# Altium schematic sheet CON_HOSTJTAG_10WBOXHDRRAM.SchDoc: Host JTAG Header
size A4; Organization: Altium Limited.; Address1: Level 3, 12a Rodborough Rd; Address2: Frenchs Forest 2086; Address3: NSW; Address4: AUSTRALIA; SheetNumber: 1; SheetTotal: 100
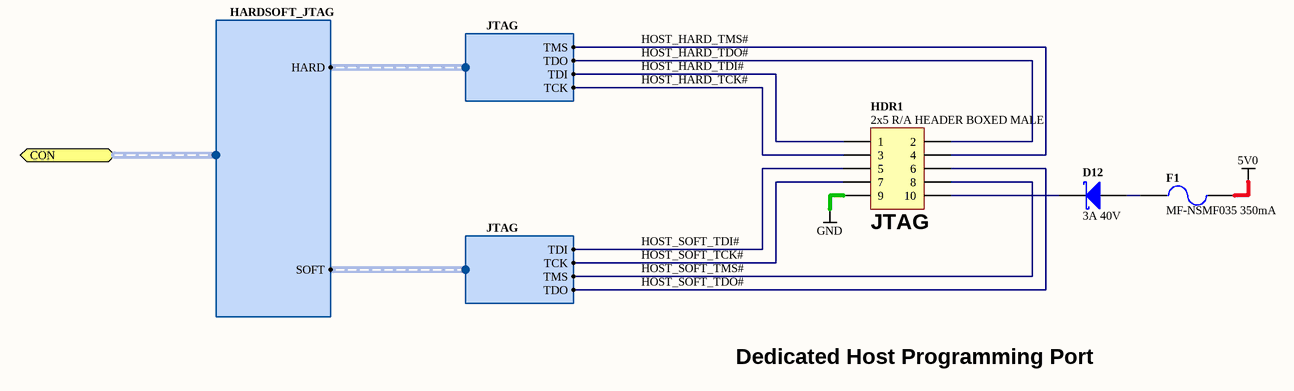
[diagram p0: CON_HOSTJTAG_10WBOXHDRRAM.SchDoc]

## Parts
D12  3A 40V  [DIOM5027]
F1  MF-NSMF035 350mA  [RESC3216]
HDR1  2x5 R/A HEADER BOXED MALE  [918510x323]

## Ports
CON (harness HARDSOFT_JTAG)

## Harnesses
JTAG: TMS, TDO, TDI, TCK
HARDSOFT_JTAG: HARD, SOFT

## Nets
5V0: F1.2
GND: HDR1.9
HOST_HARD_TCK#: HDR1.3 ; harness JTAG.TCK
HOST_HARD_TDI#: HDR1.1 ; harness JTAG.TDI
HOST_HARD_TDO#: HDR1.2 ; harness JTAG.TDO
HOST_HARD_TMS#: HDR1.4 ; harness JTAG.TMS
HOST_SOFT_TCK#: HDR1.7 ; harness JTAG.TCK
HOST_SOFT_TDI#: HDR1.5 ; harness JTAG.TDI
HOST_SOFT_TDO#: HDR1.6 ; harness JTAG.TDO
HOST_SOFT_TMS#: HDR1.8 ; harness JTAG.TMS
NetD12_1: D12.1(A) F1.1
NetD12_2: D12.2(K) HDR1.10

## Notes on the sheet
- (near HDR1) JTAG
- Dedicated Host Programming Port
- Sheet Title
- Project Title
- Size:
- Date:
- A4
- Assy:
- Time:
- Revision:
- Sheet
- of
- File:

## Library data of the parts
D12 = D-151-0000: Schottky Diode, 3A 40V; Category: Diode-Schottky; Status: Production
F1 = D-106-0001: Multifuse, SMD 1206, 350mA; Rated Voltage: 6 V; Amperage: 350 mA; Category: Fuse
HDR1 = D-300-0014: Header IDC, 2 x 5 Pin Right-Angle 2.54mm Pitch (Boxed-Male); Max Current: 3 A; Category: Connector; Connector type: Header; Mounting Technology: Through-Hole; Pin Count: 10; Status: Production